# EAGLE schematic teensyShield3 (EAGLE 7.5.0)
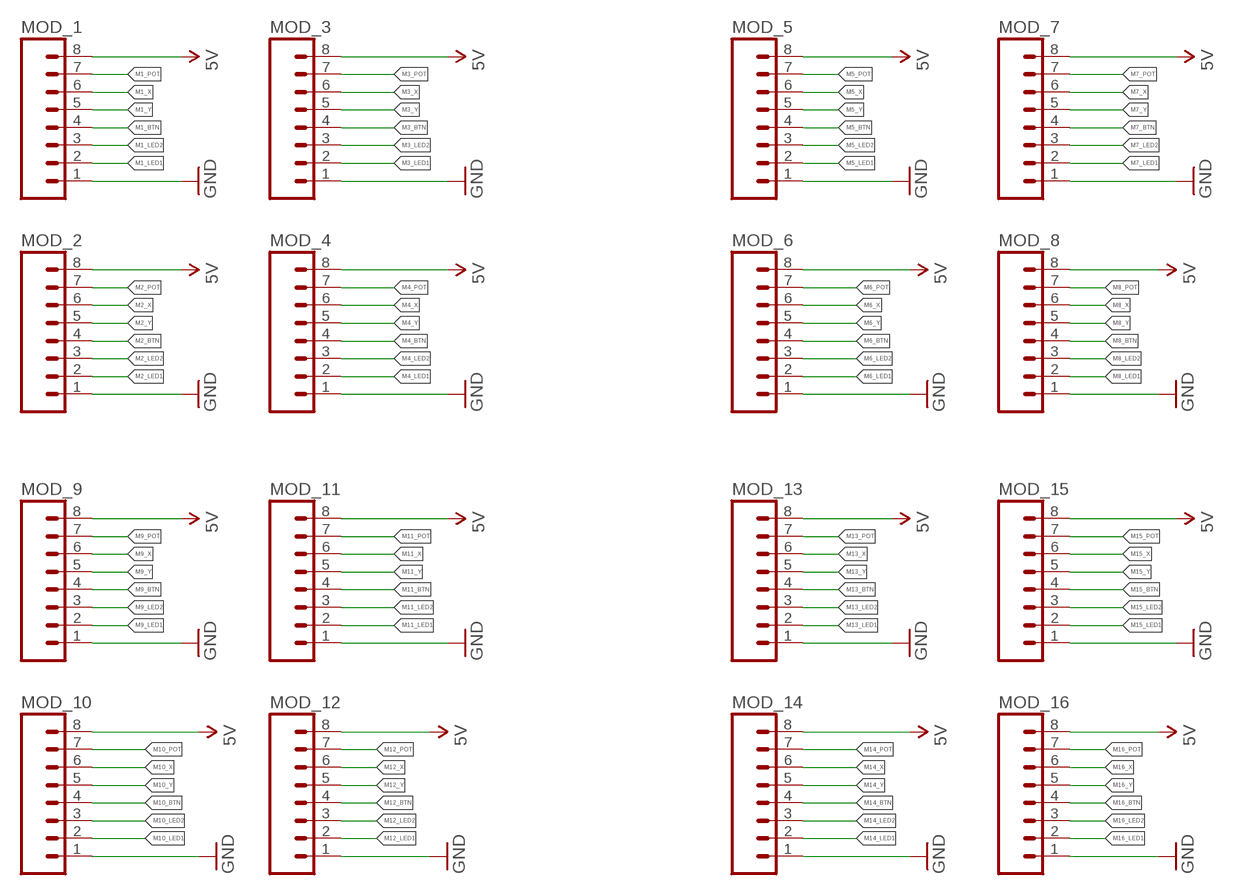
[diagram p0: schematic, sheet 1]

## Parts
MOD_1  M08  [1X08_ROUND]
MOD_2  M08  [1X08_ROUND]
MOD_3  M08  [1X08_ROUND]
MOD_4  M08  [1X08_ROUND]
MOD_5  M08  [1X08_ROUND]
MOD_6  M08  [1X08_ROUND]
MOD_7  M08  [1X08_ROUND]
MOD_8  M08  [1X08_ROUND]
MOD_9  M08  [1X08_ROUND]
MOD_10  M08  [1X08_ROUND]
MOD_11  M08  [1X08_ROUND]
MOD_12  M08  [1X08_ROUND]
MOD_13  M08  [1X08_ROUND]
MOD_14  M08  [1X08_ROUND]
MOD_15  M08  [1X08_ROUND]
MOD_16  M08  [1X08_ROUND]

## Nets
5V: MOD_1.8 MOD_2.8 MOD_3.8 MOD_4.8 MOD_5.8 MOD_6.8 MOD_7.8 MOD_8.8 MOD_9.8 MOD_10.8 MOD_11.8 MOD_12.8 MOD_13.8 MOD_14.8 MOD_15.8 MOD_16.8
GND: MOD_1.1 MOD_2.1 MOD_3.1 MOD_4.1 MOD_5.1 MOD_6.1 MOD_7.1 MOD_8.1 MOD_9.1 MOD_10.1 MOD_11.1 MOD_12.1 MOD_13.1 MOD_14.1 MOD_15.1 MOD_16.1
M1_BTN: MOD_1.4
M1_LED1: MOD_1.2
M1_LED2: MOD_1.3
M1_POT: MOD_1.7
M1_X: MOD_1.6
M1_Y: MOD_1.5
M2_BTN: MOD_2.4
M2_LED1: MOD_2.2
M2_LED2: MOD_2.3
M2_POT: MOD_2.7
M2_X: MOD_2.6
M2_Y: MOD_2.5
M3_BTN: MOD_3.4
M3_LED1: MOD_3.2
M3_LED2: MOD_3.3
M3_POT: MOD_3.7
M3_X: MOD_3.6
M3_Y: MOD_3.5
M4_BTN: MOD_4.4
M4_LED1: MOD_4.2
M4_LED2: MOD_4.3
M4_POT: MOD_4.7
M4_X: MOD_4.6
M4_Y: MOD_4.5
M5_BTN: MOD_5.4
M5_LED1: MOD_5.2
M5_LED2: MOD_5.3
M5_POT: MOD_5.7
M5_X: MOD_5.6
M5_Y: MOD_5.5
M6_BTN: MOD_6.4
M6_LED1: MOD_6.2
M6_LED2: MOD_6.3
M6_POT: MOD_6.7
M6_X: MOD_6.6
M6_Y: MOD_6.5
M7_BTN: MOD_7.4
M7_LED1: MOD_7.2
M7_LED2: MOD_7.3
M7_POT: MOD_7.7
M7_X: MOD_7.6
M7_Y: MOD_7.5
M8_BTN: MOD_8.4
M8_LED1: MOD_8.2
M8_LED2: MOD_8.3
M8_POT: MOD_8.7
M8_X: MOD_8.6
M8_Y: MOD_8.5
M9_BTN: MOD_9.4
M9_LED1: MOD_9.2
M9_LED2: MOD_9.3
M9_POT: MOD_9.7
M9_X: MOD_9.6
M9_Y: MOD_9.5
M10_BTN: MOD_10.4
M10_LED1: MOD_10.2
M10_LED2: MOD_10.3
M10_POT: MOD_10.7
M10_X: MOD_10.6
M10_Y: MOD_10.5
M11_BTN: MOD_11.4
M11_LED1: MOD_11.2
M11_LED2: MOD_11.3
M11_POT: MOD_11.7
M11_X: MOD_11.6
M11_Y: MOD_11.5
M12_BTN: MOD_12.4
M12_LED1: MOD_12.2
M12_LED2: MOD_12.3
M12_POT: MOD_12.7
M12_X: MOD_12.6
M12_Y: MOD_12.5
M13_BTN: MOD_13.4
M13_LED1: MOD_13.2
M13_LED2: MOD_13.3
M13_POT: MOD_13.7
M13_X: MOD_13.6
M13_Y: MOD_13.5
M14_BTN: MOD_14.4
M14_LED1: MOD_14.2
M14_LED2: MOD_14.3
M14_POT: MOD_14.7
M14_X: MOD_14.6
M14_Y: MOD_14.5
M15_BTN: MOD_15.4
M15_LED1: MOD_15.2
M15_LED2: MOD_15.3
M15_POT: MOD_15.7
M15_X: MOD_15.6
M15_Y: MOD_15.5
M16_BTN: MOD_16.4
M16_LED1: MOD_16.2
M16_LED2: MOD_16.3
M16_POT: MOD_16.7
M16_X: MOD_16.6
M16_Y: MOD_16.5

## Library data of the parts
MOD_1-MOD_16 = SparkFun-Connectors:M08: Header 8 Standard 8-pin 0.1" header. Use with straight break away headers (SKU : PRT-00116), right angle break away headers (PRT-00553), swiss pins (PRT-00743), machine pins (PRT-00117), and female headers (PRT-00115).; PROD_ID: CONN-08437